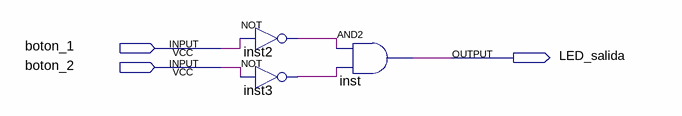
[diagram p0: schematic sheet]
// Quartus schematic lab0.bdf as structural Verilog: 3 symbols, 3 pins
module lab0 (
  input  boton_1,
  input  boton_2,
  output LED_salida
);

  wire inst2_out, inst3_out;

  not inst2 (inst2_out, boton_1);
  not inst3 (inst3_out, boton_2);
  and inst (LED_salida, inst2_out, inst3_out);
endmodule
